# Altium schematic sheet TLD.SchDoc
size Letter; SheetNumber: 1; SheetTotal: 8
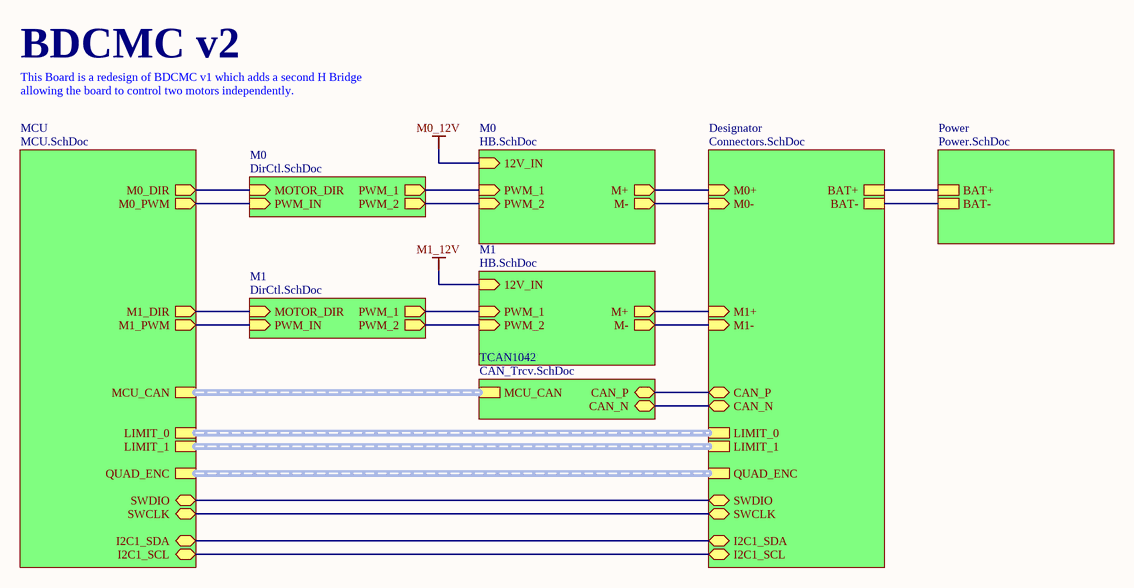
[diagram p0: TLD.SchDoc]

## Sub-sheets
Designator = Connectors.SchDoc: M0+ (in), M0- (in), I2C1_SCL (bidir), M1+ (in), M1- (in), LIMIT_0 (harness LIMIT_0), LIMIT_1 (harness LIMIT_1), CAN_P (bidir), CAN_N (bidir), BAT-, BAT+, QUAD_ENC (harness QUAD_ENC), SWDIO (bidir), SWCLK (bidir), I2C1_SDA (bidir)
M0 = DirCtl.SchDoc: PWM_1 (out), PWM_2 (out), MOTOR_DIR (in), PWM_IN (in)
M0 = HB.SchDoc: M+ (out), M- (out), PWM_1 (in), PWM_2 (in), 12V_IN (in)
M1 = DirCtl.SchDoc: PWM_1 (out), PWM_2 (out), MOTOR_DIR (in), PWM_IN (in)
M1 = HB.SchDoc: M+ (out), M- (out), PWM_1 (in), PWM_2 (in), 12V_IN (in)
MCU = MCU.SchDoc: I2C1_SDA (bidir), I2C1_SCL (bidir), SWCLK (bidir), SWDIO (bidir), LIMIT_0 (harness LIMIT_0), LIMIT_1 (harness LIMIT_1), MCU_CAN (harness MCU_CAN), M1_PWM (out), M1_DIR (out), M0_PWM (out), M0_DIR (out), QUAD_ENC (harness QUAD_ENC)
Power = Power.SchDoc: BAT+, BAT-
TCAN1042 = CAN_Trcv.SchDoc: MCU_CAN (harness MCU_CAN), CAN_P (bidir), CAN_N (bidir)

## Nets
M0_12V: sheet M0/12V_IN
M1_12V: sheet M1/12V_IN
(unnamed): sheet Designator/M0+, sheet M0/M+
(unnamed): sheet Designator/M0-, sheet M0/M-
(unnamed): sheet Designator/I2C1_SCL, sheet MCU/I2C1_SCL
(unnamed): sheet Designator/M1+, sheet M1/M+
(unnamed): sheet Designator/M1-, sheet M1/M-
(unnamed): sheet Designator/CAN_P, sheet TCAN1042/CAN_P
(unnamed): sheet Designator/CAN_N, sheet TCAN1042/CAN_N
(unnamed): sheet Designator/BAT-, sheet Power/BAT-
(unnamed): sheet Designator/BAT+, sheet Power/BAT+
(unnamed): sheet Designator/SWDIO, sheet MCU/SWDIO
(unnamed): sheet Designator/SWCLK, sheet MCU/SWCLK
(unnamed): sheet Designator/I2C1_SDA, sheet MCU/I2C1_SDA
(unnamed): sheet M0/PWM_1, sheet M0/PWM_1
(unnamed): sheet M0/PWM_2, sheet M0/PWM_2
(unnamed): sheet M0/MOTOR_DIR, sheet MCU/M0_DIR
(unnamed): sheet M0/PWM_IN, sheet MCU/M0_PWM
(unnamed): sheet M1/PWM_1, sheet M1/PWM_1
(unnamed): sheet M1/PWM_2, sheet M1/PWM_2
(unnamed): sheet M1/MOTOR_DIR, sheet MCU/M1_DIR
(unnamed): sheet M1/PWM_IN, sheet MCU/M1_PWM

## Buses and harness runs
harness sheet Designator/LIMIT_0 = sheet MCU/LIMIT_0
harness sheet Designator/LIMIT_1 = sheet MCU/LIMIT_1
harness sheet Designator/QUAD_ENC = sheet MCU/QUAD_ENC
harness sheet MCU/MCU_CAN = sheet TCAN1042/MCU_CAN

## Notes on the sheet
- BDCMC v2
- This Board is a redesign of BDCMC v1 which adds a second H Bridge allowing the board to control two motors independently.